# EAGLE schematic 524_kaya (EAGLE 9.5.1)
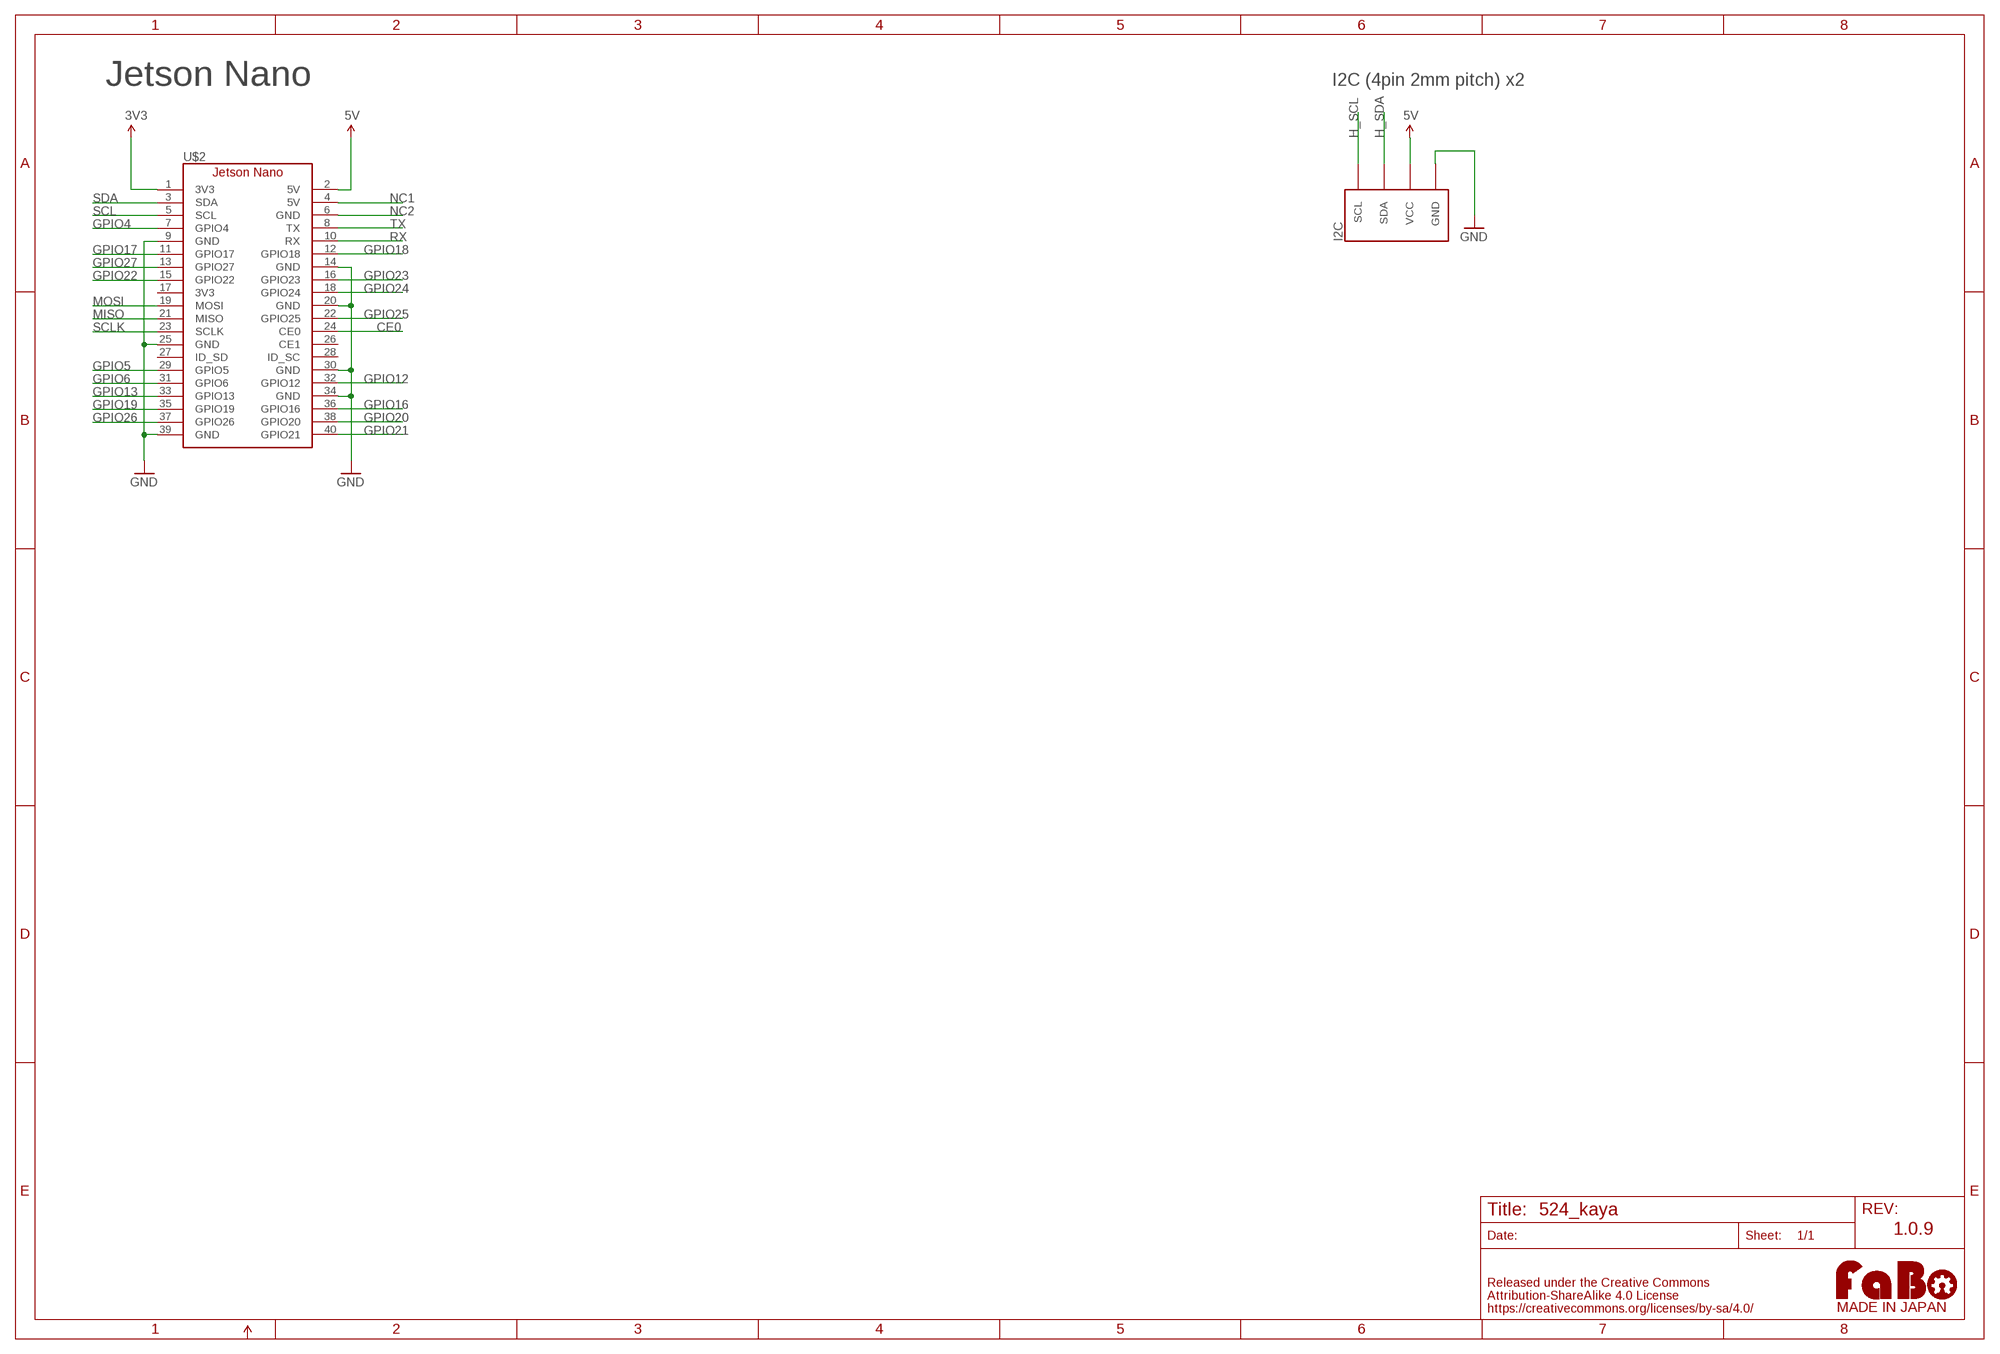
[diagram p0: schematic, sheet 1]

## Parts
I2C  FABO_BRICK_I2C-B04B-PASK-1  [FABO_BRICK_I2C_B04B-PASK-1]
U$2  JETSON_NANO_NOBORDER  [JETSON_NANO_NOBOARDER]
U$14  LOGO_FABO-M  [LOGO_FABO_MS]

## Nets
3V3: U$2.1(3V3)
5V: I2C.VCC U$2.2(5V)
CE0: U$2.24(CE0)
GND: I2C.GND U$2.9(GND) U$2.14(GND) U$2.20(GND) U$2.25(GND) U$2.30(GND) U$2.34(GND) U$2.39(GND)
GPIO4: U$2.7(GPIO4)
GPIO5: U$2.29(GPIO5)
GPIO6: U$2.31(GPIO6)
GPIO12: U$2.32(GPIO12)
GPIO13: U$2.33(GPIO13)
GPIO16: U$2.36(GPIO16)
GPIO17: U$2.11(GPIO17)
GPIO18: U$2.12(GPIO18)
GPIO19: U$2.35(GPIO19)
GPIO20: U$2.38(GPIO20)
GPIO21: U$2.40(GPIO21)
GPIO22: U$2.15(GPIO22)
GPIO23: U$2.16(GPIO23)
GPIO24: U$2.18(GPIO24)
GPIO25: U$2.22(GPIO25)
GPIO26: U$2.37(GPIO26)
GPIO27: U$2.13(GPIO27)
H_SCL: I2C.SCL
H_SDA: I2C.SDA
MISO: U$2.21(MISO)
MOSI: U$2.19(MOSI)
NC1: U$2.4(5V)
NC2: U$2.6(GND)
RX: U$2.10(RX)
SCL: U$2.5(SCL)
SCLK: U$2.23(SCLK)
SDA: U$2.3(SDA)
TX: U$2.8(TX)
Unconnected: U$2.17(3V3) U$2.26(CE1) U$2.27(ID_SD) U$2.28(ID_SC)

## Notes on the sheet
- Jetson Nano | I2C (4pin 2mm pitch) x2
- 1.0.9

## Library data of the parts
I2C = FaBo-Template:FABO_BRICK_I2C: FaBo Brick I2C
U$2 = FaBo-Boards:JETSON_NANO
U$14 = FaBo-etc:LOGO_FABO